# EAGLE design Attiny85_Blinking_Led_FIS2018 (EAGLE 9.2.1)
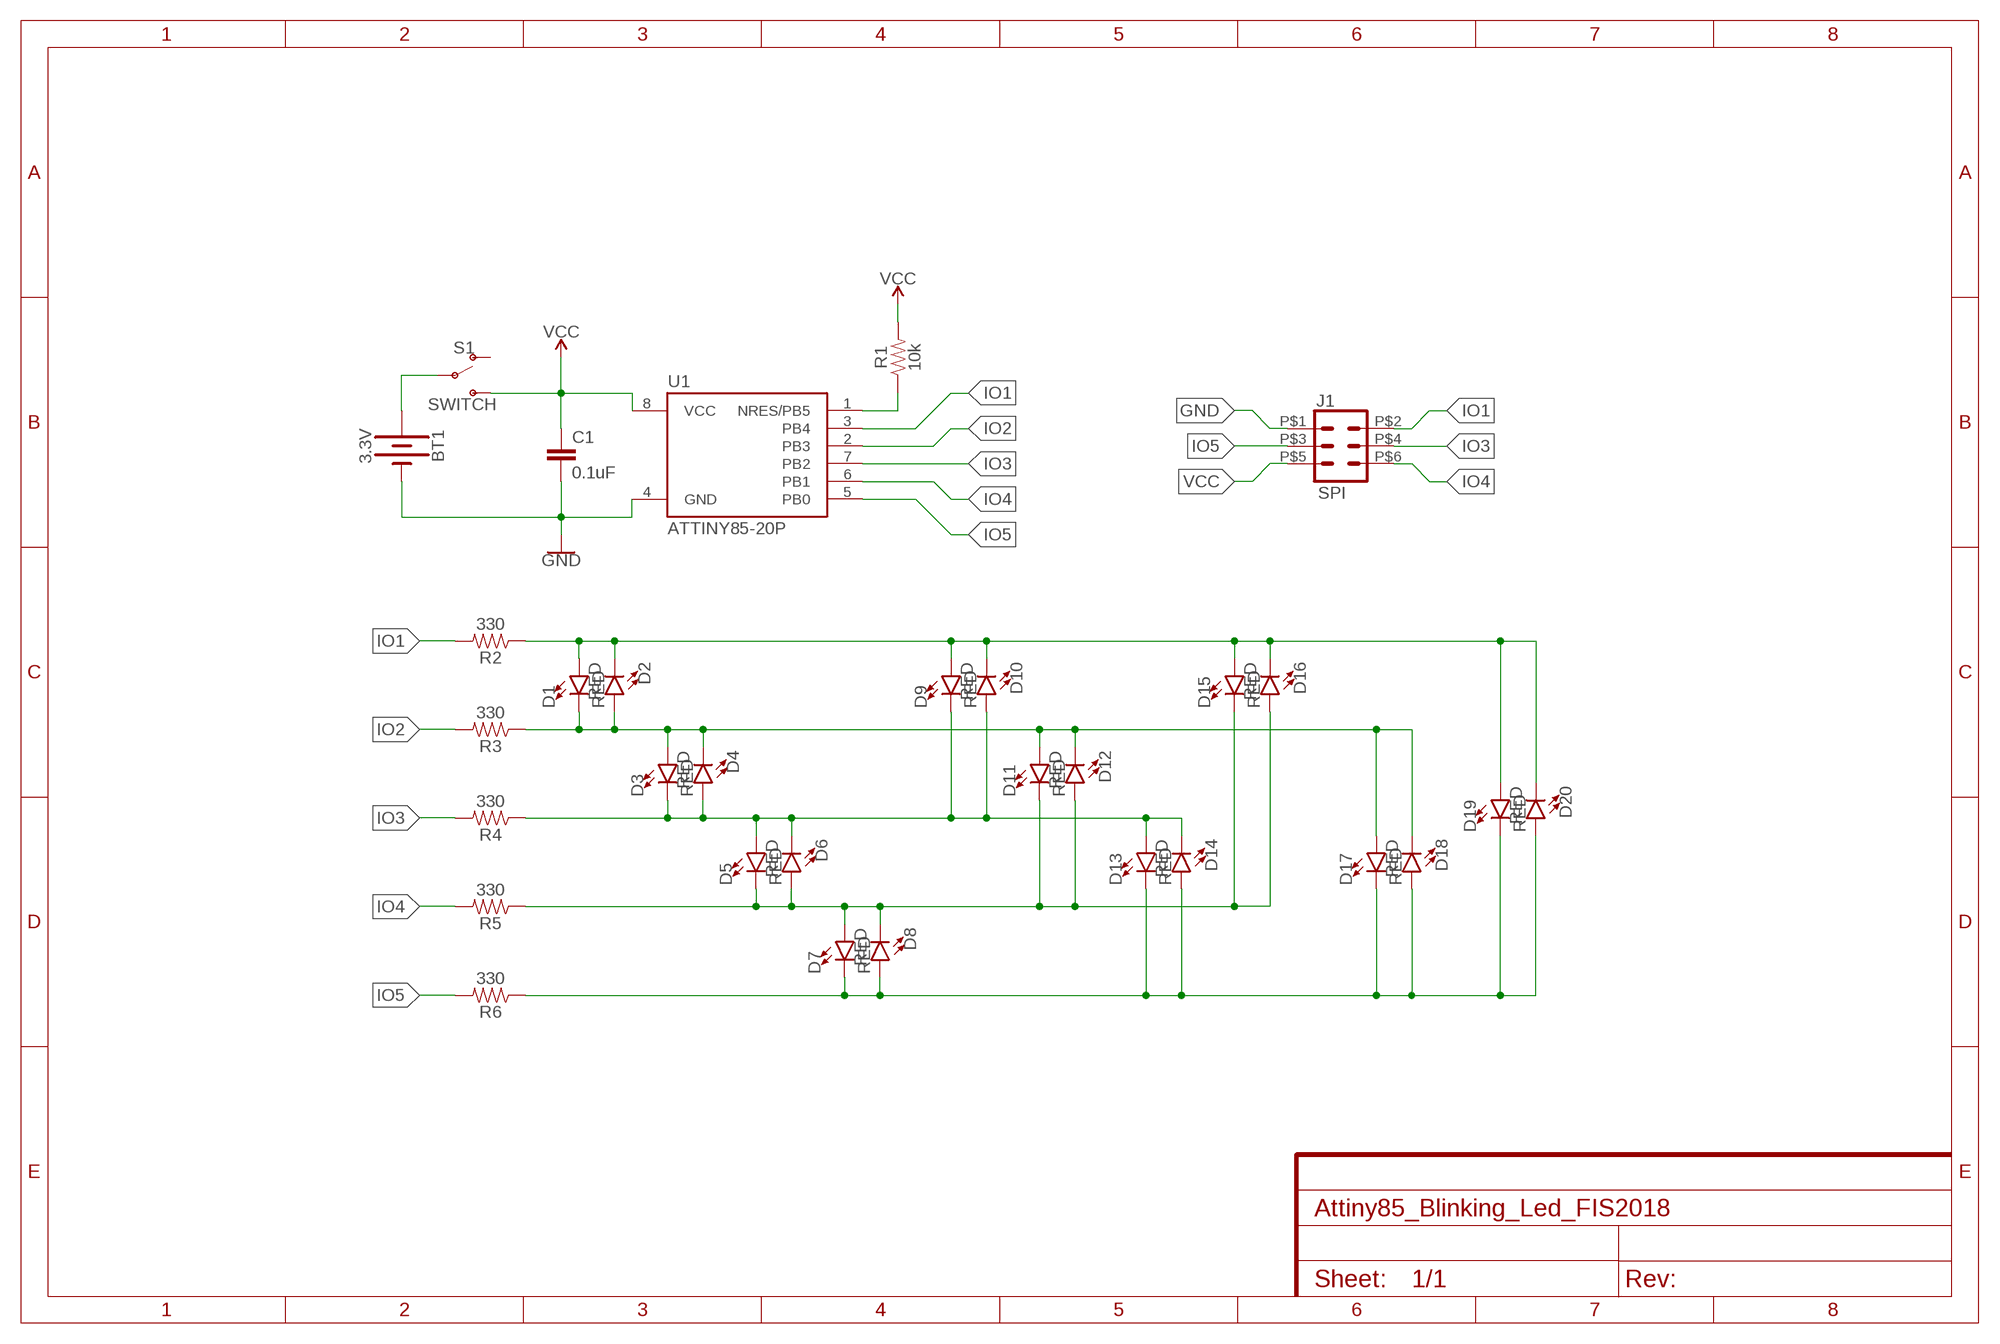
[diagram p0: schematic, sheet 1]

## Parts
BT1  3.3V  BATTERY-20MM_SMD_4LEGS  [BATTCON_20MM_4LEGS]
C1  0.1uF  0.1UF-0603-25V-(+80/-20%)  [0603]
D1  RED  LED3MM  [LED_3MM]
D2  RED  LED3MM  [LED_3MM]
D3  RED  LED3MM  [LED_3MM]
D4  RED  LED3MM  [LED_3MM]
D5  RED  LED3MM  [LED_3MM]
D6  RED  LED3MM  [LED_3MM]
D7  RED  LED3MM  [LED_3MM]
D8  RED  LED3MM  [LED_3MM]
D9  RED  LED3MM  [LED_3MM]
D10  RED  LED3MM  [LED_3MM]
D11  RED  LED3MM  [LED_3MM]
D12  RED  LED3MM  [LED_3MM]
D13  RED  LED3MM  [LED_3MM]
D14  RED  LED3MM  [LED_3MM]
D15  RED  LED3MM  [LED_3MM]
D16  RED  LED3MM  [LED_3MM]
D17  RED  LED3MM  [LED_3MM]
D18  RED  LED3MM  [LED_3MM]
D19  RED  LED3MM  [LED_3MM]
D20  RED  LED3MM  [LED_3MM]
J1  SPI  CONN_03X2POGO_PINS  [2X3_POGO]
R1  10k  10KOHM-HORIZ-1/4W-1%  [AXIAL-0.3]
R2  330  10KOHM-HORIZ-1/4W-1%  [AXIAL-0.3]
R3  330  10KOHM-HORIZ-1/4W-1%  [AXIAL-0.3]
R4  330  10KOHM-HORIZ-1/4W-1%  [AXIAL-0.3]
R5  330  10KOHM-HORIZ-1/4W-1%  [AXIAL-0.3]
R6  330  10KOHM-HORIZ-1/4W-1%  [AXIAL-0.3]
S1  SWITCH  SWITCH-SPDT-SMD-RIGHT-ANGLE  [SWITCH_SPST_SMD_A]
U1  ATTINY85-20P  [PDIP08_300MIL]

## Nets
GND: BT1.NEGATIVE(-) C1.2 J1.P$1 U1.4(GND)
IO1: J1.P$2 R2.P$2 U1.3(PB4)
IO2: R3.P$2 U1.2(PB3)
IO3: J1.P$4 R4.P$2 U1.7(PB2)
IO4: J1.P$6 R5.P$2 U1.6(PB1)
IO5: J1.P$3 R6.P$2 U1.5(PB0)
IO11: D1.A D2.K(C) D9.A D10.K(C) D15.A D16.K(C) D19.A D20.K(C) R2.P$1
IO22: D1.K(C) D2.A D3.A D4.K(C) D11.A D12.K(C) D17.A D18.K(C) R3.P$1
IO33: D3.K(C) D4.A D5.A D6.K(C) D9.K(C) D10.A D13.A D14.K(C) R4.P$1
IO44: D5.K(C) D6.A D7.A D8.K(C) D11.K(C) D12.A D15.K(C) D16.A R5.P$1
IO55: D7.K(C) D8.A D13.K(C) D14.A D17.K(C) D18.A D19.K(C) D20.A R6.P$1
N$1: R1.P$1 U1.1(NRES/PB5)
N$2: BT1.POSITIVE@1(+) BT1.POSITIVE@2(+) BT1.POSITIVE@3(+) BT1.POSITIVE@4(+) S1.2(P)
VCC: C1.1 J1.P$5 R1.P$2 S1.3(S) U1.8(VCC)
Unconnected: S1.1(O)

## Library data of the parts
BT1 = SparkFun-Batteries:BATTERY: Battery - Single Cell A variety of battery chemistries, sizes, and footprints. Device List: 20MM_PTH - Coin Cell Battery Holder - 20mm (PTH) <https://www.sparkfun.com/products/783> 20MM_PTH_KIT- Coin Cell battery Holder - 20 mm (PTH) <http://www.sparkfun.com/products/783>kit version with special mask 6.8MM_PTH - Coin Cell Battery Holder - 6.8MM(SMD) <https://www.digikey.com/product-detail/en/seiko-instruments/MS621FE-FL11E/728-1057-ND/1889208?WT.srch=1&gclid=CNOQ5a6LzdQCFZS2wAodXCkE0g> 12MM_SMD - Coin Cell Battery Holder - 12mm (SMD) <https://www.sparkfun.com/products/10592> 12MM_PTH - Coin Cell Battery Holder - 12mm (PTH) <https://www.sparkfun.com/products/7948> 20MM_SMD - 20mm Coin Cell Battery Holder (SMD) (2 legs) Used on the Big Time Watch Kit <https://www.sparkfun.com/products/11734> 20MM_SMD_4LEGS - Coin Cell Battery Holder - 20mm (SMD) <https://www.sparkfun.com/products/11892> 20MM_SMD_4LEGS_OVERPASTE - Coin Cell Battery Holder - 20mm (SMD) <https://www.sparkfun.com/products/11892> (Over-paste on the legs) 24.5MM_PTH - Coin Cell Battery Holder - 24.5mm (PTH) <https://www.sparkfun.com/products/8863> 9V - 9V Battery Holder - PC Mount Used on the SparkFun SparkPunk Sound Kit <https://www.sparkfun.com/products/11177> and SparkFun SparkPunk Sequencer Kit <https://www.sparkfun.com/products/12707> 18650 - Battery Holder - 18650 (PTH) <https://www.sparkfun.com/products/13113> AA - Battery Holder - 1xAA (PTH) <https://www.sparkfun.com/products/7949> AAA - Battery Holder - 1xAAA (PTH) <https://www.sparkfun.com/products/12718> AA_KIT - Battery Holder - 1xAA (PTH) <https://www.sparkfun.com/products/7949> Special kit package - pads only have exposed copper on one side of the board. AAA_KIT - Battery Holder - 1xAAA (PTH) <https://www.sparkfun.com/products/12718> Special kit package - pads only have exposed copper on one side of the board.; PROD_ID: BATT-10373; SF_SKU: PRT-11892
C1 = SparkFun-Capacitors:0.1UF: 0.1µF ceramic capacitors A capacitor is a passive two-terminal electrical component used to store electrical energy temporarily in an electric field.; PROD_ID: CAP-00810
D1-D20 = SparkFun-LED:LED: LED (Generic) Standard schematic elements and footprints for 5mm, 3mm, 1206, and 0603 sized LEDs. Generic LEDs with no color specified.; PROD_ID: DIO-08794
J1 = SparkFun-Connectors:CONN_03X2: Multi connection point. Often used as Generic Header-pin footprint for 0.1 inch spaced/style header connections You can populate with any combo of single row headers, but if you'd like an exact match, check these: Header - 2x3 (Male, 0.1") <https://www.sparkfun.com/products/12807> (PRT-12807) Header - 2x3 (Female, 0.1") <https://www.sparkfun.com/products/13010> (PRT-13010) 2x3 Pin Shrouded Header <https://www.sparkfun.com/products/10877> (PRT-10877) On any of the 0.1 inch spaced packages, you can populate with these: Break Away Headers - Straight <https://www.sparkfun.com/products/116> (PRT-00116) Break Away Male Headers - Right Angle <https://www.sparkfun.com/products/553> (PRT-00553) Female Headers <https://www.sparkfun.com/products/115> (PRT-00115) Break Away Headers - Machine Pin <https://www.sparkfun.com/products/117> (PRT-00117) Break Away Female Headers - Swiss Machine Pin <https://www.sparkfun.com/products/743> (PRT-00743) Special note: the shrouded connector mates well with our 3x2 ribbon cables: Ribbon Crimp Connector - 6-pin (2x3, Female) <https://www.sparkfun.com/products/10651> (PRT-10651) Ribbon Cable - 6 wire (15ft) <https://www.sparkfun.com/products/10646> (PRT-10646); PROD_ID: HW-11044
R1 = SparkFun-Resistors:10KOHM: 10kΩ resistor A resistor is a passive two-terminal electrical component that implements electrical resistance as a circuit element. Resistors act to reduce current flow, and, at the same time, act to lower voltage levels within circuits. - Wikipedia; PROD_ID: RES-12183
R2-R6 = SparkFun-Resistors:10KOHM: 10kΩ resistor A resistor is a passive two-terminal electrical component that implements electrical resistance as a circuit element. Resistors act to reduce current flow, and, at the same time, act to lower voltage levels within circuits. - Wikipedia; PROD_ID: RES-12183; VALUE: 10k
S1 = SparkFun-Switches:SWITCH-SPDT: Single Pole, Double Throw (SPDT) Switch Single-pole, double-throw (SPDT) switch. Variant Overview SMD-AYZ0202 Surface Mount DPDT Switch <https://www.sparkfun.com/products/597> (COM-00597) Used on e.g. LilyPad Arduino USB - ATmega32U4 Board <https://www.sparkfun.com/products/12049> PTH-11.6X4.0MM SPDT Mini Power Switch <https://www.sparkfun.com/products/102> (COM-00102) Used on e.g. SparkFun Simon Says - Through-Hole Soldering Kit <https://www.sparkfun.com/products/10547> (KIT-10547) PTH-11.6X4.0MM-KIT KIT version of SPDT Mini Power Switch - Simplifies soldering by removing tStop of switch pins - only one side can be soldered. PTH-11.6X4.0MM-LOCK LOCK version of SPDT Mini Power Switch - Offset pins hold switch in place for easier soldering. SMD-RIGHT-ANGLE Surface Mount Right Angle Switch <https://www.sparkfun.com/products/10860> (COM-10860) Used on e.g. SparkFun ESP8266 Thing <https://www.sparkfun.com/products/13231>; PROD_ID: SWCH-10651; SF_SKU: COM-10860
U1 = _hhn_attiny25_45_85:ATTINY85*: ATMEL ATtiny 85 Packages: P = PDIP 08 30mil S = SOIC 08 EIAJ 208mil Technologies Note: for complete ordering code (temp. range, finish, tape&reel etc.) see www.atmel.com • Supply Voltage: V = (1.8…5.5)V | [blank] = (2.7…5.5)V • Speed: 10 = 10 MHz | 20 = 20 MHz Author: Dipl.-Ing. FH Rainer Bayer HHN Hochschule Heilbronn (Heilbronn University), rainer.bayer@hs-heilbronn.de Ingenieurbüro ing-rb, mail@ing-rb.de

## Board
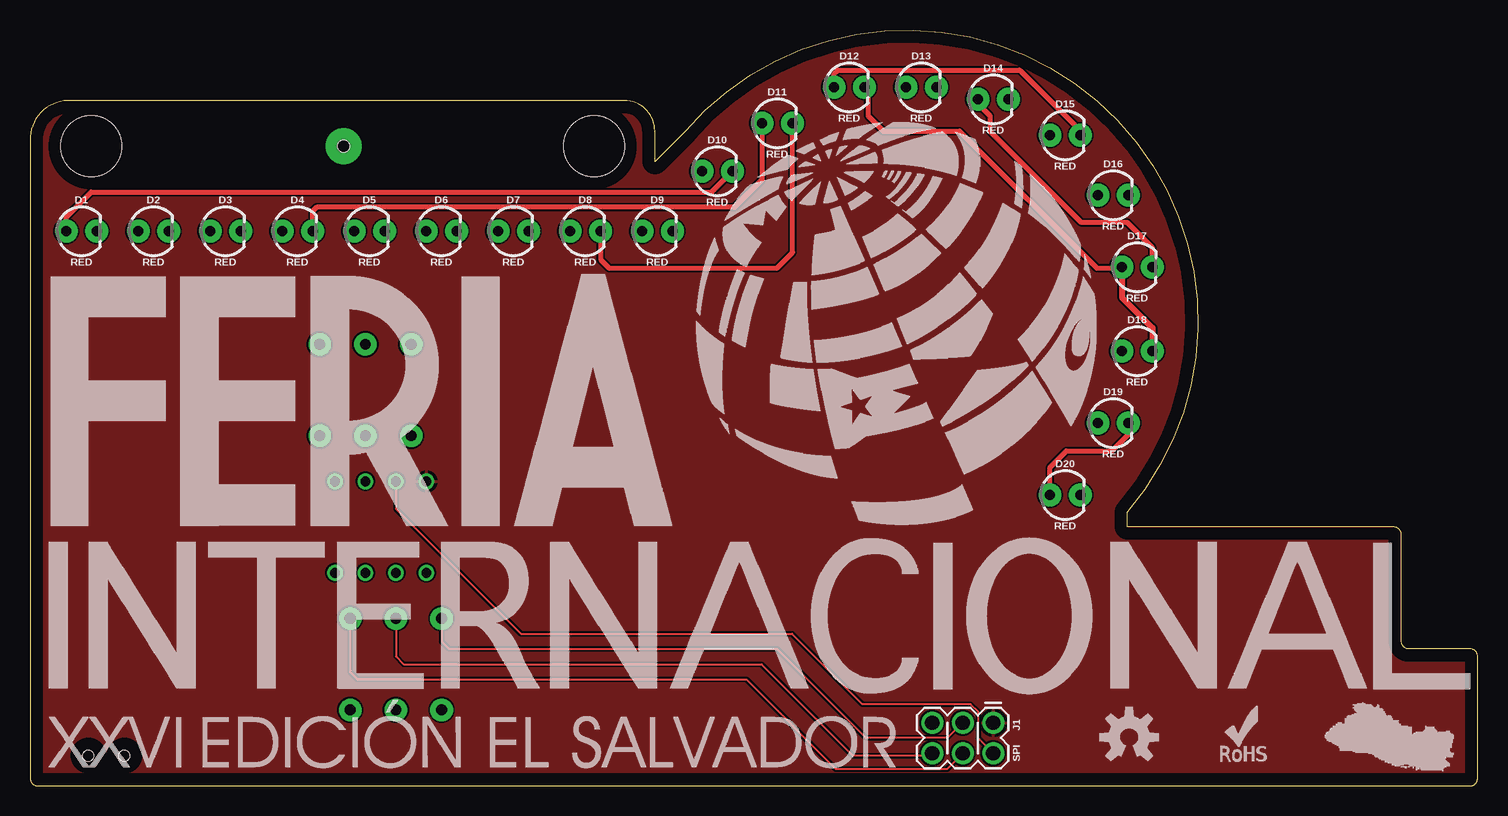
[diagram p1: board, top side]
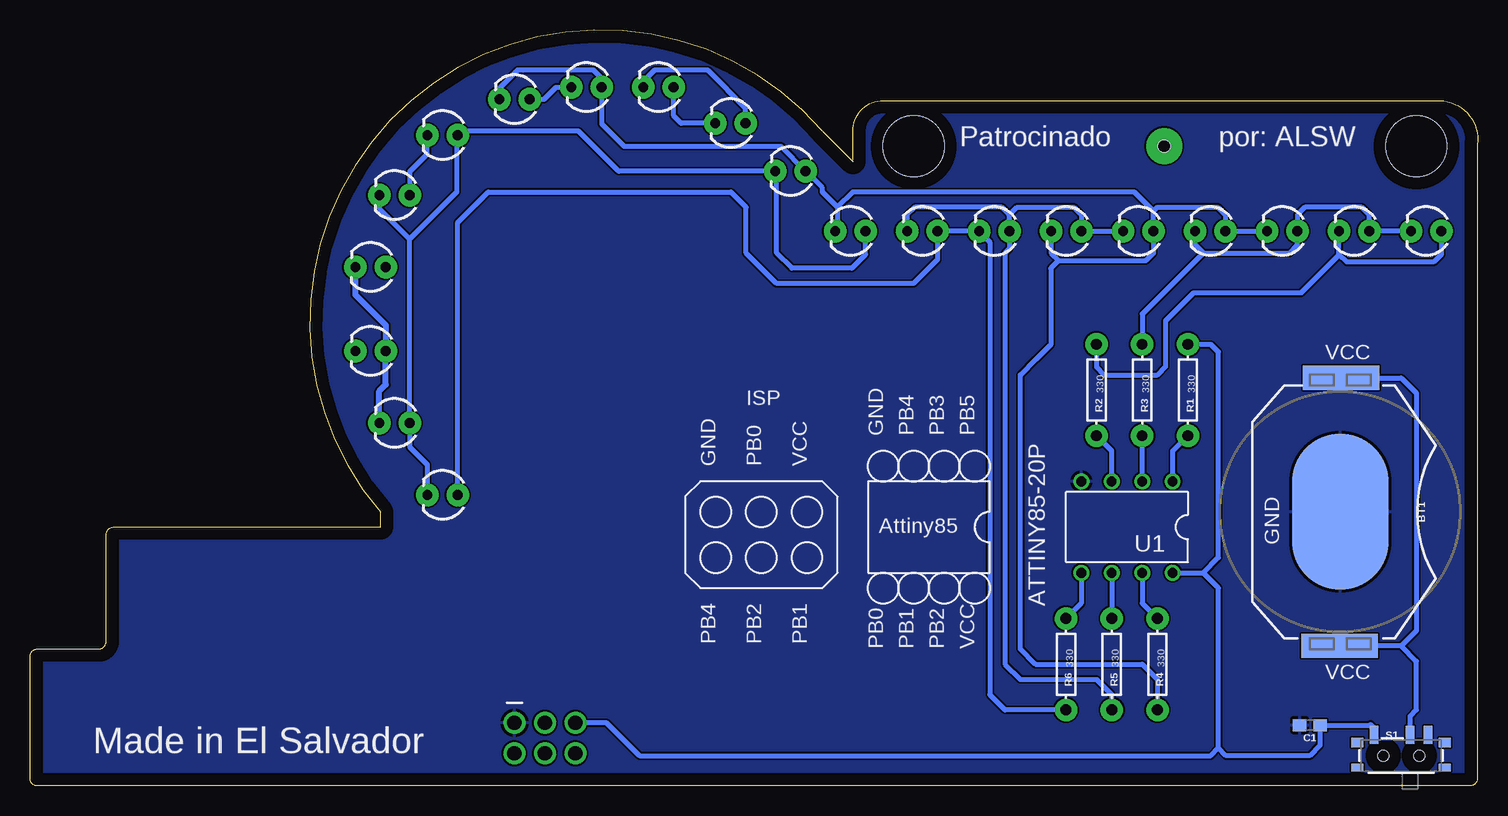
[diagram p2: board, bottom side, seen from below]

Size 120.68 x 63.04 mm. Coordinates in mm from the lower left corner, seen from the top.
Outline: 54.63,54.61 52.09,52.07 52.09,54.61 arc90 49.55,57.15 47.01,57.15 2.83,57.12 arc90 0.02,53.51 0.02,0.64 arc90 0.66,0 120.04,0 arc90 120.67,0.63 120.68,10.8 arc90 120.04,11.43 114.96,11.43 arc-90 114.32,12.06 114.32,20.95 arc90 113.69,21.59 91.46,21.59 91.46,22.86 arc180 54.63,54.61
Copper layers (1*16): Top 0.035mm / dielectric 1.5mm / Bottom 0.035mm
Design rules "default": minimum track width 6mil, minimum drill 0.35mm, track to track 6mil, track to pad 6mil, pad to pad 6mil, via to via 6mil, smd to smd 6mil, copper to edge 40mil, drill to drill 6mil, minimum pad ring 10mil, minimum via ring 8mil, stop-mask expansion 4mil, vias tented up to drill 0mil, thermal gap 10mil
Holes 5.08 mm at 47.01,53.34 5.1,53.34
Holes 1 mm at 26.14,53.37

### Footprints (pad centres in the part's own frame; a part is rotated, then mirrored left to right if it is on the bottom)
BATTCON_20MM_4LEGS = smd 13 x 8: NEGATIVE 0,0 | smd 2.032 x 3.175: POSITIVE@1 -11.176,1.651; POSITIVE@2 -11.176,-1.524; POSITIVE@3 11.176,1.524; POSITIVE@4 11.176,-1.651
0603 = smd 1.1 x 1: 1 -0.85,0; 2 0.85,0
LED_3MM = drill 0.813 pad 1.88: A -1.27,0; K 1.27,0
2X3_POGO = drill 1.2 pad 1.829: P$1 0,0; P$2 0,2.54; P$3 2.54,0; P$4 2.54,2.54; P$5 5.08,0; P$6 5.08,2.54
AXIAL-0.3 = drill 0.9 pad 1.88: P$1 -3.81,0; P$2 3.81,0
SWITCH_SPST_SMD_A = smd 0.7 x 1.5: 1 -2.25,-1.75; 2 -0.75,-1.75; 3 2.25,-1.75 | smd 1 x 0.6: GND1 -3.65,1; GND3 3.65,1 | smd 1 x 0.8: GND2 -3.65,-1.1; GND4 3.65,-1.1 | hole 0.9: -1.5,0; 1.5,0
PDIP08_300MIL = drill 0.813: 1 -3.81,-3.81; 2 -1.27,-3.81; 3 1.27,-3.81; 4 3.81,-3.81; 5 3.81,3.81; 6 1.27,3.81; 7 -1.27,3.81; 8 -3.81,3.81

### Placement (x,y rotation side)
BT1  11.45,22.86 90 bottom
C1  13.99,5.08 180 bottom
D1  4.29,46.27 0 top
D2  10.29,46.27 0 top
D3  16.29,46.27 0 top
D4  22.29,46.27 0 top
D5  28.29,46.27 0 top
D6  34.29,46.27 0 top
D7  40.29,46.27 0 top
D8  46.29,46.27 0 top
D9  52.29,46.27 0 top
D10  57.29,51.27 0 top
D11  62.29,55.27 0 top
D12  68.29,58.27 0 top
D13  74.29,58.27 0 top
D14  80.29,57.27 0 top
D15  86.29,54.27 0 top
D16  90.29,49.27 0 top
D17  92.29,43.27 0 top
D18  92.29,36.27 0 top
D19  90.29,30.27 0 top
D20  86.29,24.27 0 top
J1  80.29,5.27 180 top
R1  24.15,33.02 90 bottom
R2  31.77,33.02 270 bottom
R3  27.96,33.02 270 bottom
R4  26.69,10.16 90 bottom
R5  30.5,10.16 90 bottom
R6  34.31,10.16 90 bottom
S1  6.37,2.54 180 bottom
U1  29.23,21.59 180 bottom
U$1  [OSHW-LOGO-M]  91.63,4.06 0 top
U$2  [ROHS_LOGO_0.18_IN]  99,1.95 0 top

### Tracks (layer width: path | path; a pad name or v marks a point on that pad's centre or on a via)
GND
  pour Bottom: 123.21,66.04 123.21,0.64 arc-90 122.58,0 0.66,0 arc-90 0.02,0.64 0.02,66.04
  pour Top: 0.02,0 0.02,66.04 123.21,66.04 123.21,0
IO1
  Top 0.152: U1.3 30.5,23.11 40.92,12.7 63.52,12.7 69.39,6.83 78.41,6.83 79.04,6.2 79.04,3.98 J1.P$2
  Bottom 0.406: U1.3 30.5,27.94 R2.P$2
IO2
  Bottom 0.406: U1.2 R3.P$2
IO3
  Top 0.152: R4.P$2 26.69,9.53 27.33,8.89 59.71,8.89 67.2,1.4 76.42,1.4 J1.P$4
  Bottom 0.406: U1.7 27.96,15.24 R4.P$2
IO4
  Top 0.152: R5.P$2 30.5,10.79 31.14,10.16 60.98,10.16 68.6,2.54 75.02,2.54 J1.P$6
  Bottom 0.406: U1.6 R5.P$2
IO5
  Top 0.152: J1.P$3 76.5,4.01 69.67,4.01 62.25,11.43 34.95,11.43 34.31,12.06 R6.P$2
  Bottom 0.406: R6.P$2 33.04,15.24 U1.5
IO11
  Top 0.406: D1.A 3.02,47.45 5.1,49.53 56.82,49.53 D10.K
  Bottom 0.406: D20.K 87.56,26.81 89.02,28.27 D19.A 89.02,45.62 | D9.A 51.02,44.32 52.17,43.18 57.17,43.18 58.44,44.45 58.44,51.15 D10.K 71.61,51.27 74.95,54.61 84.68,54.61 D15.A 85.11,54.18 85.11,49.53 89.02,45.62 | 11.56,44.28 14.74,41.11 23.68,41.11 26.02,38.77 26.02,34.96 26.69,34.29 31.14,34.29 31.77,34.92 R2.P$1 | D1.A 3.02,44.32 3.66,43.69 10.93,43.69 11.53,44.28 11.56,44.28 | D16.K 91.56,48.16 89.02,45.62 | 11.56,44.28 D2.K
IO22
  Top 0.406: D11.A 61.02,50.56 58.73,48.26 23.9,48.26 23.58,47.94 23.56,47.96 D4.K | D12.K 69.87,57.96 69.87,55.88 71.14,54.61 77.49,54.61 88.92,43.18 91.02,43.18
  Top 0.508: D17.A 91.02,43.18 91.02,40.73 93.56,38.19 D18.K
  Bottom 0.406: D1.K D2.A 9.02,47.62 9.66,48.26 14.39,48.26 15.02,47.62 D3.A 15.02,45.09 15.66,44.45 22.88,44.45 | 22.88,44.45 27.96,39.37 R3.P$1 | D4.K 23.56,45.13 22.88,44.45 | D11.A 61.02,56.54 64.17,59.69 68.6,59.69 69.56,58.73 D12.K
IO33
  Bottom 0.406: D3.K D4.A 21.02,47.62 21.66,48.26 26.69,48.26 27.02,47.93 | D6.K 35.56,44.44 34.93,43.81 | 34.93,43.81 27.66,43.81 27.02,44.44 D5.A 27.02,47.93 | R4.P$1 26.69,8.89 27.96,10.16 36.85,10.16 38.12,11.43 38.12,34.29 36.85,35.56 36.83,35.56 35.58,36.81 35.58,43.18 34.96,43.81 34.93,43.81 | 53.36,48.26 52.09,49.53 28.62,49.53 27.02,47.93 | 53.36,48.26 53.36,46.47 D9.K | D14.K 81.56,58.16 80.03,59.69 73.68,59.69 73.02,59.03 D13.A 73.02,55.22 71.14,53.34 58.09,53.34 D10.A 54.63,49.88 54.63,49.53 53.36,48.26
IO44
  Top 0.406: D12.A 67.02,59.38 67.33,59.69 82.47,59.69 82.55,59.65 87.56,54.64 D15.K | D8.K 47.56,43.9 48.28,43.18 62.25,43.18 63.56,44.49 D11.K
  Bottom 0.406: D5.K D6.A 33.04,46.29 33.04,47.62 33.68,48.26 38.39,48.26 39.02,47.62 | D15.K 87.56,52.7 89.02,51.24 D16.A | D8.K 47.56,47.62 46.93,48.26 39.66,48.26 39.02,47.62 | 39.02,47.62 D7.A 39.02,44.82 39.39,44.45 39.39,10.16 38.12,8.89 31.77,8.89 30.5,7.62 R5.P$1 | D11.K 66.39,55.27 67.02,55.91 D12.A
IO55
  Top 0.406: D20.A 85.02,26.58 86.38,27.94 90.19,27.94 91.56,29.31 D19.K | D14.A 79.02,56.89 80.03,55.88 80.03,54.61 87.65,46.99 91.46,46.99 93.56,44.89 D17.K
  Bottom 0.406: D14.A 77.83,57.27 76.83,58.27 D13.K | R6.P$1 39.39,6.35 40.66,7.62 40.66,45.37 D7.K D8.A 45.02,43.9 47.01,41.91 58.44,41.91 60.98,44.45 60.98,48.26 62.25,49.53 82.48,49.53 85.02,46.99 D20.A
  Bottom 0.508: D17.K 93.56,40.96 91.02,38.42 D18.A 91.02,33.46 91.56,32.92 D19.K
N$1
  Bottom 0.406: U1.1 25.42,27.94 R1.P$1
N$2
  Bottom 0.406: 6.37,11.68 5.1,12.95 5.1,32.77 6.37,34.04 BT1.POSITIVE@4 BT1.POSITIVE@3 | 6.37,11.68 BT1.POSITIVE@2 BT1.POSITIVE@1 | S1.2 5.62,5.83 5.1,6.35 5.1,10.41 6.37,11.68
N$3  (via drill 1 pad 3)
  other vias: 26.14,53.37
VCC
  Bottom 0.406: 22.88,17.78 21.61,16.51 21.61,3.17 | 22.88,17.78 21.61,19.05 21.61,36.2 22.25,36.83 R1.P$2 | U1.8 22.88,17.78 | 21.61,3.17 22.25,2.54 69.87,2.54 72.6,5.27 J1.P$5 | 8.91,5.08 C1.1 13.14,3.39 13.99,2.54 20.98,2.54 21.61,3.17
  Bottom 0.508: 8.91,5.08 8.62,4.79 S1.3

### Text on the board
bPlace: por: ALSW | Patrocinado | VCC | 330 | 330 | 330 | ISP | PB5 | PB3 | PB4 | GND | VCC | PB0 | GND | GND | Attiny85 | PB1 | PB2 | PB4 | 330 | 330 | 330 | VCC | PB2 | PB1 | PB0 | VCC | Made in El Salvador
bStop: github.com/alswnet/FeriaInternacional2018Badge